# EAGLE design dreamblaster (EAGLE 7.3.0)
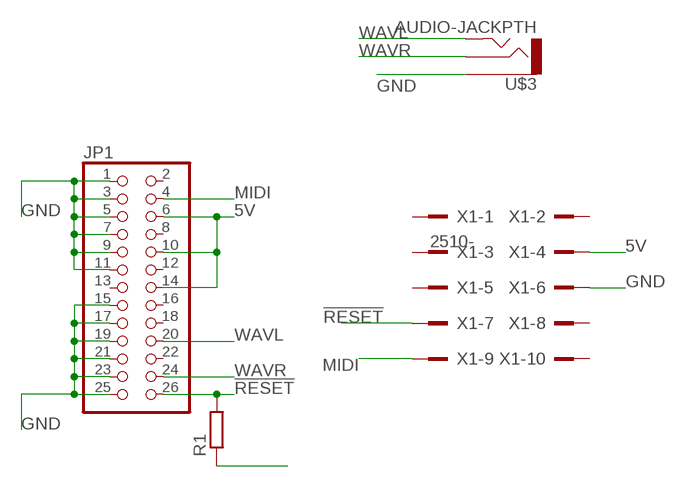
[diagram p0: schematic, sheet 1]

## Parts
JP1  PINHD-2X13  [2X13]
R1  R-EU_0204/7  [0204/7]
U$3  AUDIO-JACKPTH  [AUDIO-JACK]
X1  2510-  [PAK100/2500-10]

## Nets
5V: JP1.6 JP1.10 JP1.14 R1.1 X1.4
!RESET: JP1.26 R1.2 X1.7
GND: JP1.1 JP1.3 JP1.5 JP1.7 JP1.9 JP1.11 JP1.15 JP1.17 JP1.19 JP1.21 JP1.23 JP1.25 U$3.1 X1.6
MIDI: JP1.4 X1.9
WAVL: JP1.20 U$3.5
WAVR: JP1.24 U$3.2
Unconnected: JP1.2 JP1.8 JP1.12 JP1.13 JP1.16 JP1.18 JP1.22 X1.1 X1.2 X1.3 X1.5 X1.8 X1.10

## Library data of the parts
JP1 = pinhead:PINHD-2X13: PIN HEADER
R1 = rcl:R-EU_: RESISTOR, European symbol
U$3 = SparkFun:AUDIO-JACK: 3.5mm Audio Jack Simple 3.5mm common PCB mount audio jack. SKU: PRT-08032
X1 = con-3m:2510-: 3M (TM) Pak 100 4-Wall Header Source: 3M; MF: 3M; MPN: 2510-6002UB; OC_FARNELL: 9838244; OC_NEWARK: 46F4725

## Board
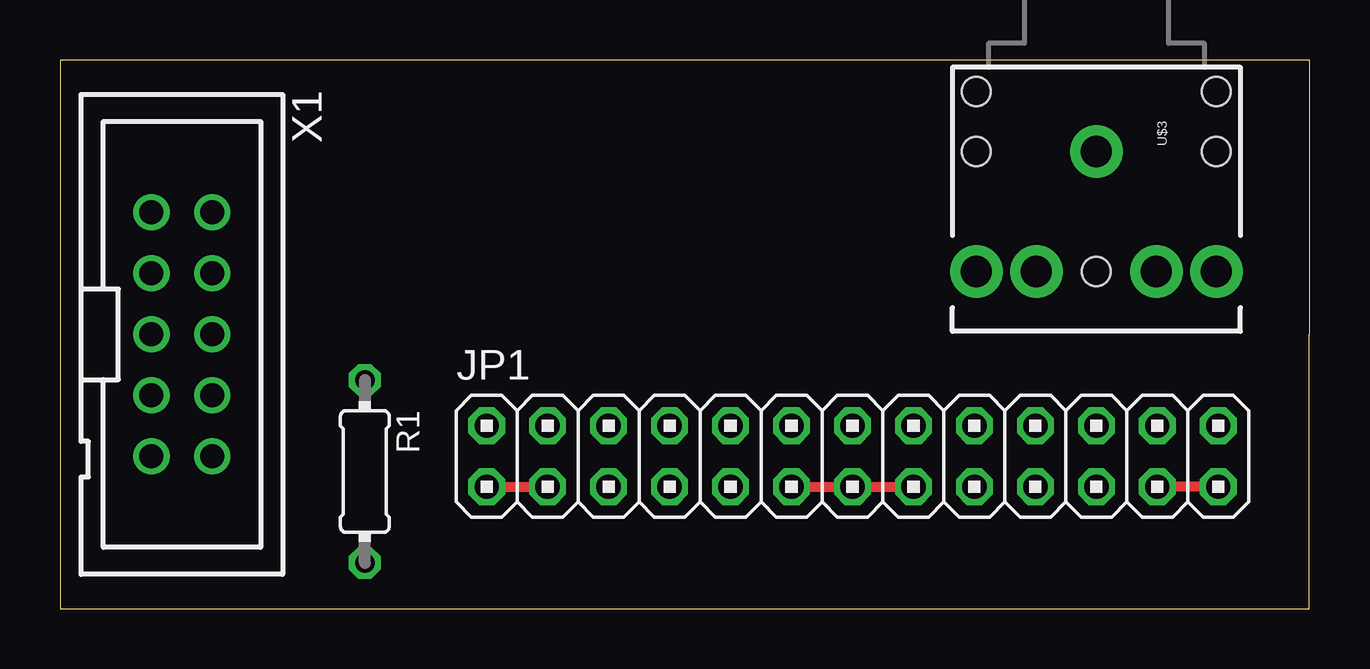
[diagram p1: board, top side]
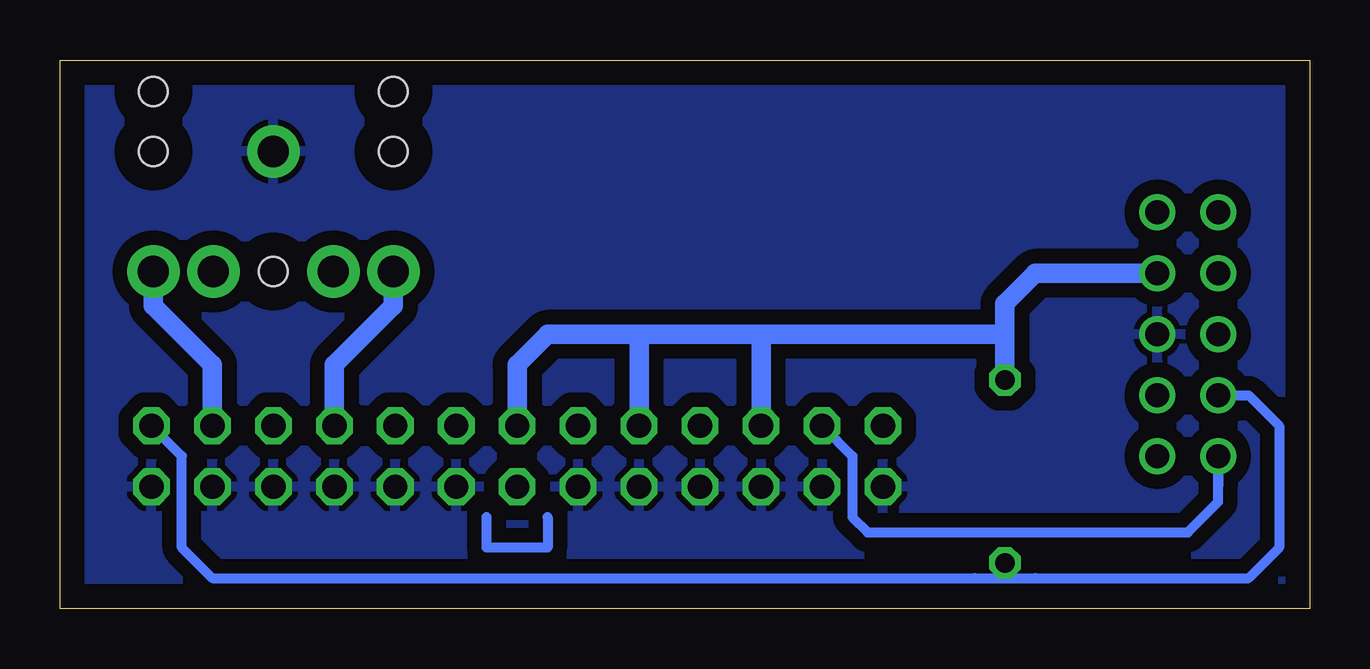
[diagram p2: board, bottom side, seen from below]

Size 52.07 x 22.86 mm. Coordinates in mm from the lower left corner, seen from the top.
Outline: 0,0 52.05,0 52.07,22.86 0,22.86 0,0
Copper layers (1*16): Top 0.035mm / dielectric 1.5mm / Bottom 0.035mm
Design rules "default": minimum track width 10mil, minimum drill 24mil, track to track 8mil, track to pad 8mil, pad to pad 8mil, via to via 8mil, smd to smd 8mil, copper to edge 40mil, drill to drill 8mil, minimum pad ring 10mil, minimum via ring 8mil, stop-mask expansion 4mil, vias tented up to drill 0mil, thermal gap 10mil

### Footprints (pad centres in the part's own frame; a part is rotated, then mirrored left to right if it is on the bottom)
2X13 = drill 1.016 octagon: 1 -15.24,-1.27; 2 -15.24,1.27; 3 -12.7,-1.27; 4 -12.7,1.27; 5 -10.16,-1.27; 6 -10.16,1.27; 7 -7.62,-1.27; 8 -7.62,1.27; 9 -5.08,-1.27; 10 -5.08,1.27; 11 -2.54,-1.27; 12 -2.54,1.27; 13 0,-1.27; 14 0,1.27; 15 2.54,-1.27; 16 2.54,1.27; 17 5.08,-1.27; 18 5.08,1.27; 19 7.62,-1.27; 20 7.62,1.27; 21 10.16,-1.27; 22 10.16,1.27; 23 12.7,-1.27; 24 12.7,1.27; 25 15.24,-1.27; 26 15.24,1.27
0204/7 = drill 0.813 octagon: 1 -3.81,0; 2 3.81,0
AUDIO-JACK = drill 1.3 pad 2.184: 1 0,0; 2 5,5; 3 5,2.5; 4 5,-2.5; 5 5,-5 | hole 1.2: 0,5; -2.5,5; -2.5,-5; 0,-5; 5,0
PAK100/2500-10 = drill 1 pad 1.422: 1 -5.08,-1.27; 2 -5.08,1.27; 3 -2.54,-1.27; 4 -2.54,1.27; 5 0,-1.27; 6 0,1.27; 7 2.54,-1.27; 8 2.54,1.27; 9 5.08,-1.27; 10 5.08,1.27

### Placement (x,y rotation side)
JP1  33.02,6.35 0 top
R1  12.7,5.71 270 top
U$3  43.18,19.05 270 top
X1  5.08,11.43 270 top

### Tracks (layer width: path | path; a pad name or v marks a point on that pad's centre or on a via)
5V
  Bottom 0.813: 12.7,11.43 22.86,11.43 | 22.86,11.43 27.94,11.43 | 27.94,11.43 31.75,11.43 33.02,10.16 JP1.14 | JP1.10 27.94,11.43 | JP1.6 22.86,11.43 | X1.4 11.43,13.97 12.7,12.7 12.7,11.43 | 12.7,11.43 R1.1
!RESET
  Bottom 0.406: X1.7 2.54,8.89 1.27,7.62 1.27,2.54 2.54,1.27 11.43,1.27 12.7,1.27 | 12.7,1.27 13.97,1.27 45.72,1.27 46.99,2.54 46.99,6.35 JP1.26 | R1.2 12.7,1.27
GND
  Top 0.406: JP1.25 JP1.23 | JP1.1 JP1.3 | JP1.11 JP1.15
  pour Bottom (isolate 0.61): 0,22.86 52.07,22.86 52.07,0 0,0
MIDI
  Bottom 0.406: 3.81,5.08 X1.9 3.81,4.44 5.08,3.17 18.41,3.17 19.05,3.81 19.05,6.35 JP1.4
N$1
  Bottom 0.406: 31.75,3.81 31.75,2.54 34.29,2.54 34.29,3.81
WAVL
  Bottom 0.813: U$3.5 38.18,12.62 40.64,10.16 JP1.20
WAVR
  Bottom 0.813: U$3.2 48.18,12.62 45.72,10.16 JP1.24